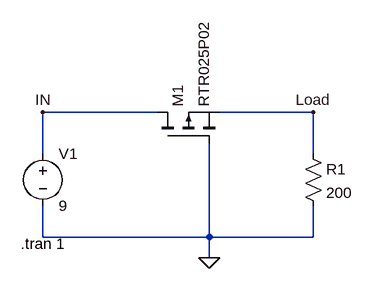
[diagram p0: schematic Reverse_Voltage_Protection.asc]
Reverse_Voltage_Protection.asc, the LTspice schematic file:
Version 4
SHEET 1 880 680
WIRE 208 64 32 64
WIRE 448 64 304 64
WIRE 32 128 32 64
WIRE 448 128 448 64
WIRE 32 256 32 208
WIRE 288 256 288 112
WIRE 288 256 32 256
WIRE 448 256 448 208
WIRE 448 256 288 256
WIRE 288 288 288 256
FLAG 288 288 0
FLAG 32 64 IN
FLAG 448 64 Load
SYMBOL voltage 32 112 R0
WINDOW 123 0 0 Left 0
WINDOW 39 0 0 Left 0
SYMATTR InstName V1
SYMATTR Value 9
SYMBOL pmos 208 112 R270
SYMATTR InstName M1
SYMATTR Value RTR025P02
SYMBOL res 432 112 R0
SYMATTR InstName R1
SYMATTR Value 200
TEXT -2 266 Left 2 !.tran 1

The netlist it stands for:
* Reverse_Voltage_Protection.asc
V1 IN 0 9
M1 IN 0 Load Load RTR025P02
R1 Load 0 200
.model NMOS NMOS
.model PMOS PMOS
.lib standard.mos
.tran 1
.backanno
.end